# EAGLE design Forward_Reverse_circuit (EAGLE 9.6.2)
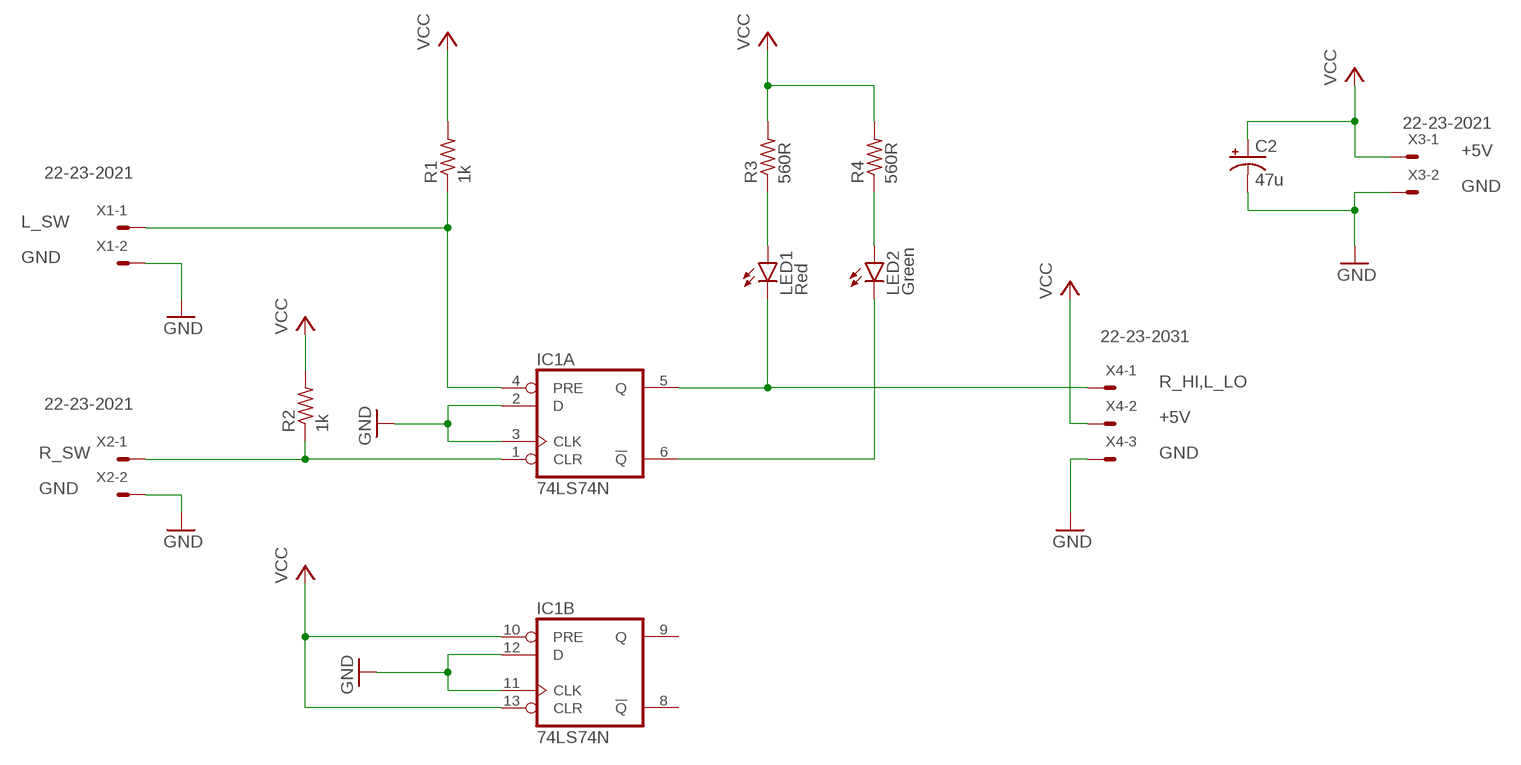
[diagram p0: schematic, sheet 1]

## Parts
C2  47u  CPOL-USE5-6  [E5-6]
IC1  74LS74N  [DIL14]
LED1  Red  LED5MM  [LED5MM]
LED2  Green  LED5MM  [LED5MM]
R1  1k  R-US_0207/12  [0207/12]
R2  1k  R-US_0207/12  [0207/12]
R3  560R  R-US_0207/12  [0207/12]
R4  560R  R-US_0207/12  [0207/12]
X1  22-23-2021  [22-23-2021]
X2  22-23-2021  [22-23-2021]
X3  22-23-2021  [22-23-2021]
X4  22-23-2031  [22-23-2031]

## Nets
+5V: C2.+ IC1.10(B:PRE) IC1.13(B:CLR) R1.2 R2.2 R3.2 R4.2 X3.1 X4.2 ; supply symbol labelled VCC
GND: C2.- IC1.2(A:D) IC1.3(A:CLK) IC1.11(B:CLK) IC1.12(B:D) X1.2 X2.2 X3.2 X4.3
L_SW: IC1.4(A:PRE) R1.1 X1.1
N$4: IC1.6(A:!Q) LED2.K(C)
N$5: LED2.A R4.1
N$6: LED1.A R3.1
R_HI,L_LO: IC1.5(A:Q) LED1.K(C) X4.1
R_SW: IC1.1(A:CLR) R2.1 X2.1
Unconnected: IC1.8(B:!Q) IC1.9(B:Q)

## Power pins joined to a net without a drawn wire
+5V: IC1.14(P:VCC)
GND: IC1.7(P:GND)

## Library data of the parts
C2 = rcl:CPOL-US: POLARIZED CAPACITOR, American symbol; SPICEPREFIX: C
IC1 = 74xx-us:74*74: Dual D type positive edge triggered FLIP FLOP, preset and clear
LED1 LED2 = led:LED: LED OSRAM: - CHIPLED LG R971, LG N971, LY N971, LG Q971, LY Q971, LO R971, LY R971 LH N974, LH R974 LS Q976, LO Q976, LY Q976 LO Q996 - Hyper CHIPLED LW Q18S LB Q993, LB Q99A, LB R99A - SideLED LS A670, LO A670, LY A670, LG A670, LP A670 LB A673, LV A673, LT A673, LW A673 LH A674 LY A675 LS A676, LA A676, LO A676, LY A676, LW A676 LS A679, LY A679, LG A679 - Hyper Micro SIDELED® LS Y876, LA Y876, LO Y876, LY Y876 LT Y87S - SmartLED LW L88C, LW L88S LB L89C, LB L89S, LG L890 LS L89K, LO L89K, LY L89K LS L896, LA L896, LO L896, LY L896 - TOPLED LS T670, LO T670, LY T670, LG T670, LP T670 LSG T670, LSP T670, LSY T670, LOP T670, LYG T670 LG T671, LOG T671, LSG T671 LB T673, LV T673, LT T673, LW T673 LH T674 LS T676, LA T676, LO T676, LY T676, LB T676, LH T676, LSB T676, LW T676 LB T67C, LV T67C, LT T67C, LS T67K, LO T67K, LY T67K, LW E67C LS E67B, LA E67B, LO E67B, LY E67B, LB E67C, LV E67C, LT E67C LW T67C LS T679, LY T679, LG T679 LS T770, LO T770, LY T770, LG T770, LP T770 LB T773, LV T773, LT T773, LW T773 LH T774 LS E675, LA E675, LY E675, LS T675 LS T776, LA T776, LO T776, LY T776, LB T776 LHGB T686 LT T68C, LB T68C - Hyper Mini TOPLED® LB M676 - Mini TOPLED Santana® LG M470 LS M47K, LO M47K, LY M47K Source: http://www.osram.convergy.de LUXEON: - LUMILED® LXK2-PW12-R00, LXK2-PW12-S00, LXK2-PW14-U00, LXK2-PW14-V00 LXK2-PM12-R00, LXK2-PM12-S00, LXK2-PM14-U00 LXK2-PE12-Q00, LXK2-PE12-R00, LXK2-PE12-S00, LXK2-PE14-T00, LXK2-PE14-U00 LXK2-PB12-K00, LXK2-PB12-L00, LXK2-PB12-M00, LXK2-PB14-N00, LXK2-PB14-P00, LXK2-PB14-Q00 LXK2-PR12-L00, LXK2-PR12-M00, LXK2-PR14-Q00, LXK2-PR14-R00 LXK2-PD12-Q00, LXK2-PD12-R00, LXK2-PD12-S00 LXK2-PH12-R00, LXK2-PH12-S00 LXK2-PL12-P00, LXK2-PL12-Q00, LXK2-PL12-R00 Source: www.luxeon.com KINGBRIGHT: KA-3528ASYC Source: www.kingbright.com
R1-R4 = rcl:R-US_: RESISTOR, American symbol; SPICEPREFIX: R
X1-X3 = con-molex:22-23-2021: .100" (2.54mm) Center Header - 2 Pin; MF: MOLEX; MPN: 22-23-2021; OC_FARNELL: 1462926; OC_NEWARK: 25C3832
X4 = con-molex:22-23-2031: .100" (2.54mm) Center Header - 3 Pin; MF: MOLEX; MPN: 22-23-2031; OC_FARNELL: 1462950; OC_NEWARK: 30C0862

## Board
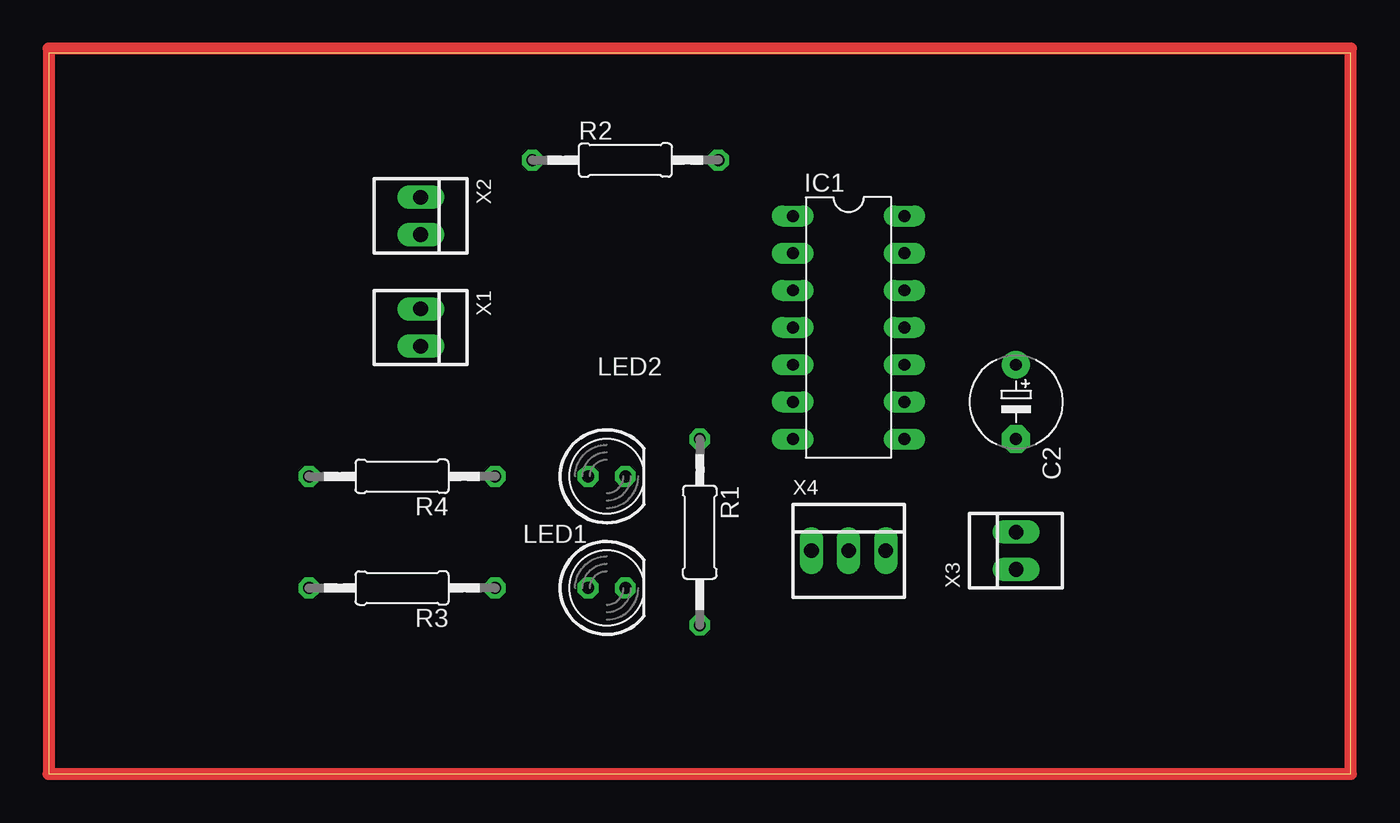
[diagram p1: board, top side]
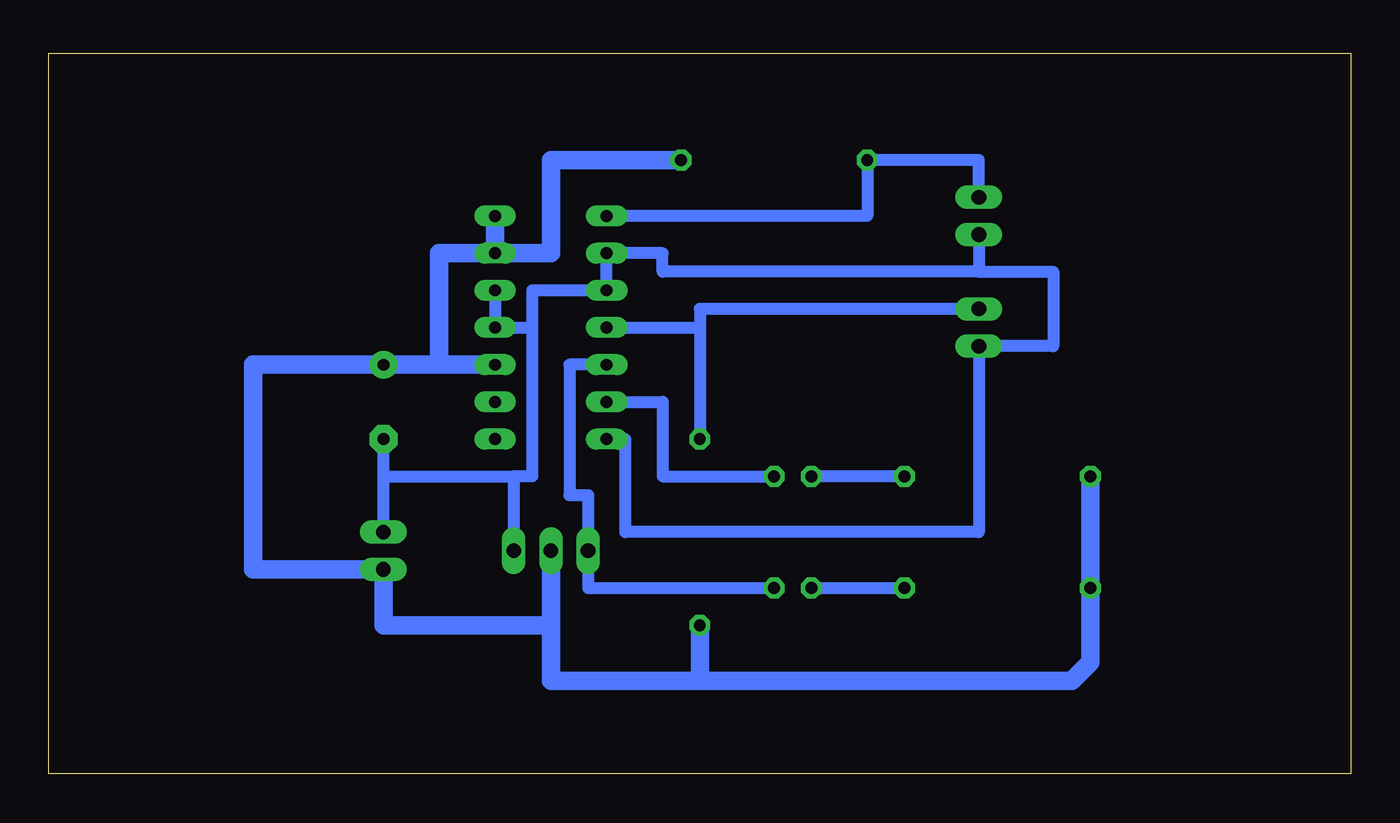
[diagram p2: board, bottom side, seen from below]

Size 88.88 x 49.2 mm. Coordinates in mm from the lower left corner, seen from the top.
Outline: 0,0 88.88,0 88.88,49.2 0,49.2 0,0
Copper layers (1*16): Top 0.035mm / dielectric 1.5mm / Bottom 0.035mm
Design rules "Forward_Reverse_circuit": minimum track width 6mil, minimum drill 0.35mm, track to track 12mil, track to pad 12mil, pad to pad 0.205mm, via to via 0.205mm, smd to smd 8mil, copper to edge 6mil, drill to drill 6mil, minimum pad ring 12mil, minimum via ring 8mil, stop-mask expansion 4mil, vias tented up to drill 0mil, thermal gap 10mil

### Footprints (pad centres in the part's own frame; a part is rotated, then mirrored left to right if it is on the bottom)
E5-6 = drill 0.813 pad 1.905: + -2.54,0 | drill 0.813 pad 1.905 octagon: - 2.54,0
DIL14 = drill 0.813 long: 1 -7.62,-3.81; 2 -5.08,-3.81; 3 -2.54,-3.81; 4 0,-3.81; 5 2.54,-3.81; 6 5.08,-3.81; 7 7.62,-3.81; 8 7.62,3.81; 9 5.08,3.81; 10 2.54,3.81; 11 0,3.81; 12 -2.54,3.81; 13 -5.08,3.81; 14 -7.62,3.81
LED5MM = drill 0.813 octagon: A -1.27,0; K 1.27,0
0207/12 = drill 0.813 octagon: 1 -6.35,0; 2 6.35,0
22-23-2021 = drill 1 long: 1 -1.27,0; 2 1.27,0
22-23-2031 = drill 1 long: 1 -2.54,0; 2 0,0; 3 2.54,0

### Placement (x,y rotation side)
C2  66.04,25.4 270 top
IC1  54.61,30.48 270 top
LED1  38.1,12.7 0 top
LED2  38.1,20.32 0 top
R1  44.45,16.51 270 top
R2  39.37,41.91 0 top
R3  24.13,12.7 180 top
R4  24.13,20.32 180 top
X1  25.4,30.48 270 top
X2  25.4,38.1 270 top
X3  66.04,15.24 90 top
X4  54.61,15.24 0 top

### Tracks (layer width: path | path; a pad name or v marks a point on that pad's centre or on a via)
+5V
  Bottom 1.27: R2.2 54.61,41.91 54.61,35.56 IC1.13 | IC1.13 IC1.14 | IC1.13 62.23,35.56 62.23,27.94 | 62.23,27.94 IC1.10 | 62.23,27.94 C2.+ 74.93,27.94 74.93,13.97 X3.1 66.04,10.16 54.61,10.16 | 54.61,10.16 X4.2 | 54.61,10.16 54.61,6.35 44.45,6.35 | 44.45,6.35 R1.2 | 44.45,6.35 19.05,6.35 17.78,7.62 R3.2 R4.2
GND
  Bottom 0.813: X2.2 25.4,34.29 | 25.4,34.29 46.99,34.29 46.99,35.56 IC1.2 IC1.3 55.88,33.02 55.88,30.48 | 55.88,30.48 IC1.11 IC1.12 | 55.88,30.48 55.88,20.32 57.15,20.32 | 57.15,20.32 X4.3 | X3.2 66.04,20.32 | 66.04,20.32 57.15,20.32 | 66.04,20.32 C2.- | 25.4,34.29 20.32,34.29 20.32,29.21 X1.2 25.4,16.51 49.53,16.51 49.53,22.86 IC1.7
L_SW
  Bottom 0.813: X1.1 44.45,31.75 44.45,30.48 | 44.45,30.48 R1.1 | IC1.4 44.45,30.48
N$1
  Top 0.813: 0,0 88.9,0 88.9,49.53 0,49.53 0,0
N$4
  Bottom 0.813: IC1.6 46.99,25.4 46.99,20.32 LED2.K
N$5
  Bottom 0.813: R4.1 LED2.A
N$6
  Bottom 0.813: LED1.A R3.1
R_HI,L_LO
  Bottom 0.813: IC1.5 53.34,27.94 53.34,19.05 52.07,19.05 X4.1 52.07,12.7 LED1.K
R_SW
  Bottom 0.813: X2.1 25.4,41.91 R2.1 33.02,38.1 IC1.1